# Altium schematic sheet 迷你四轴遥控器.SchDoc
size A3; PageSetup: Record=PageOptions|CenterHorizontal=True|CenterVertical=True|PrintScale=0.73|XCorrection=1.00|YCorrection=1.00|PrintKind=0|BorderSize=5000000|LeftOffset=0|BottomOffset=0|Orientation=2|PaperLength=1000|PaperWidth=1000|Scale=100|PaperSource=7|PrintQuality=-3|MediaType=1|DitherType=10|PrintScaleMode=1|PaperKind=A4|PaperIndex=9
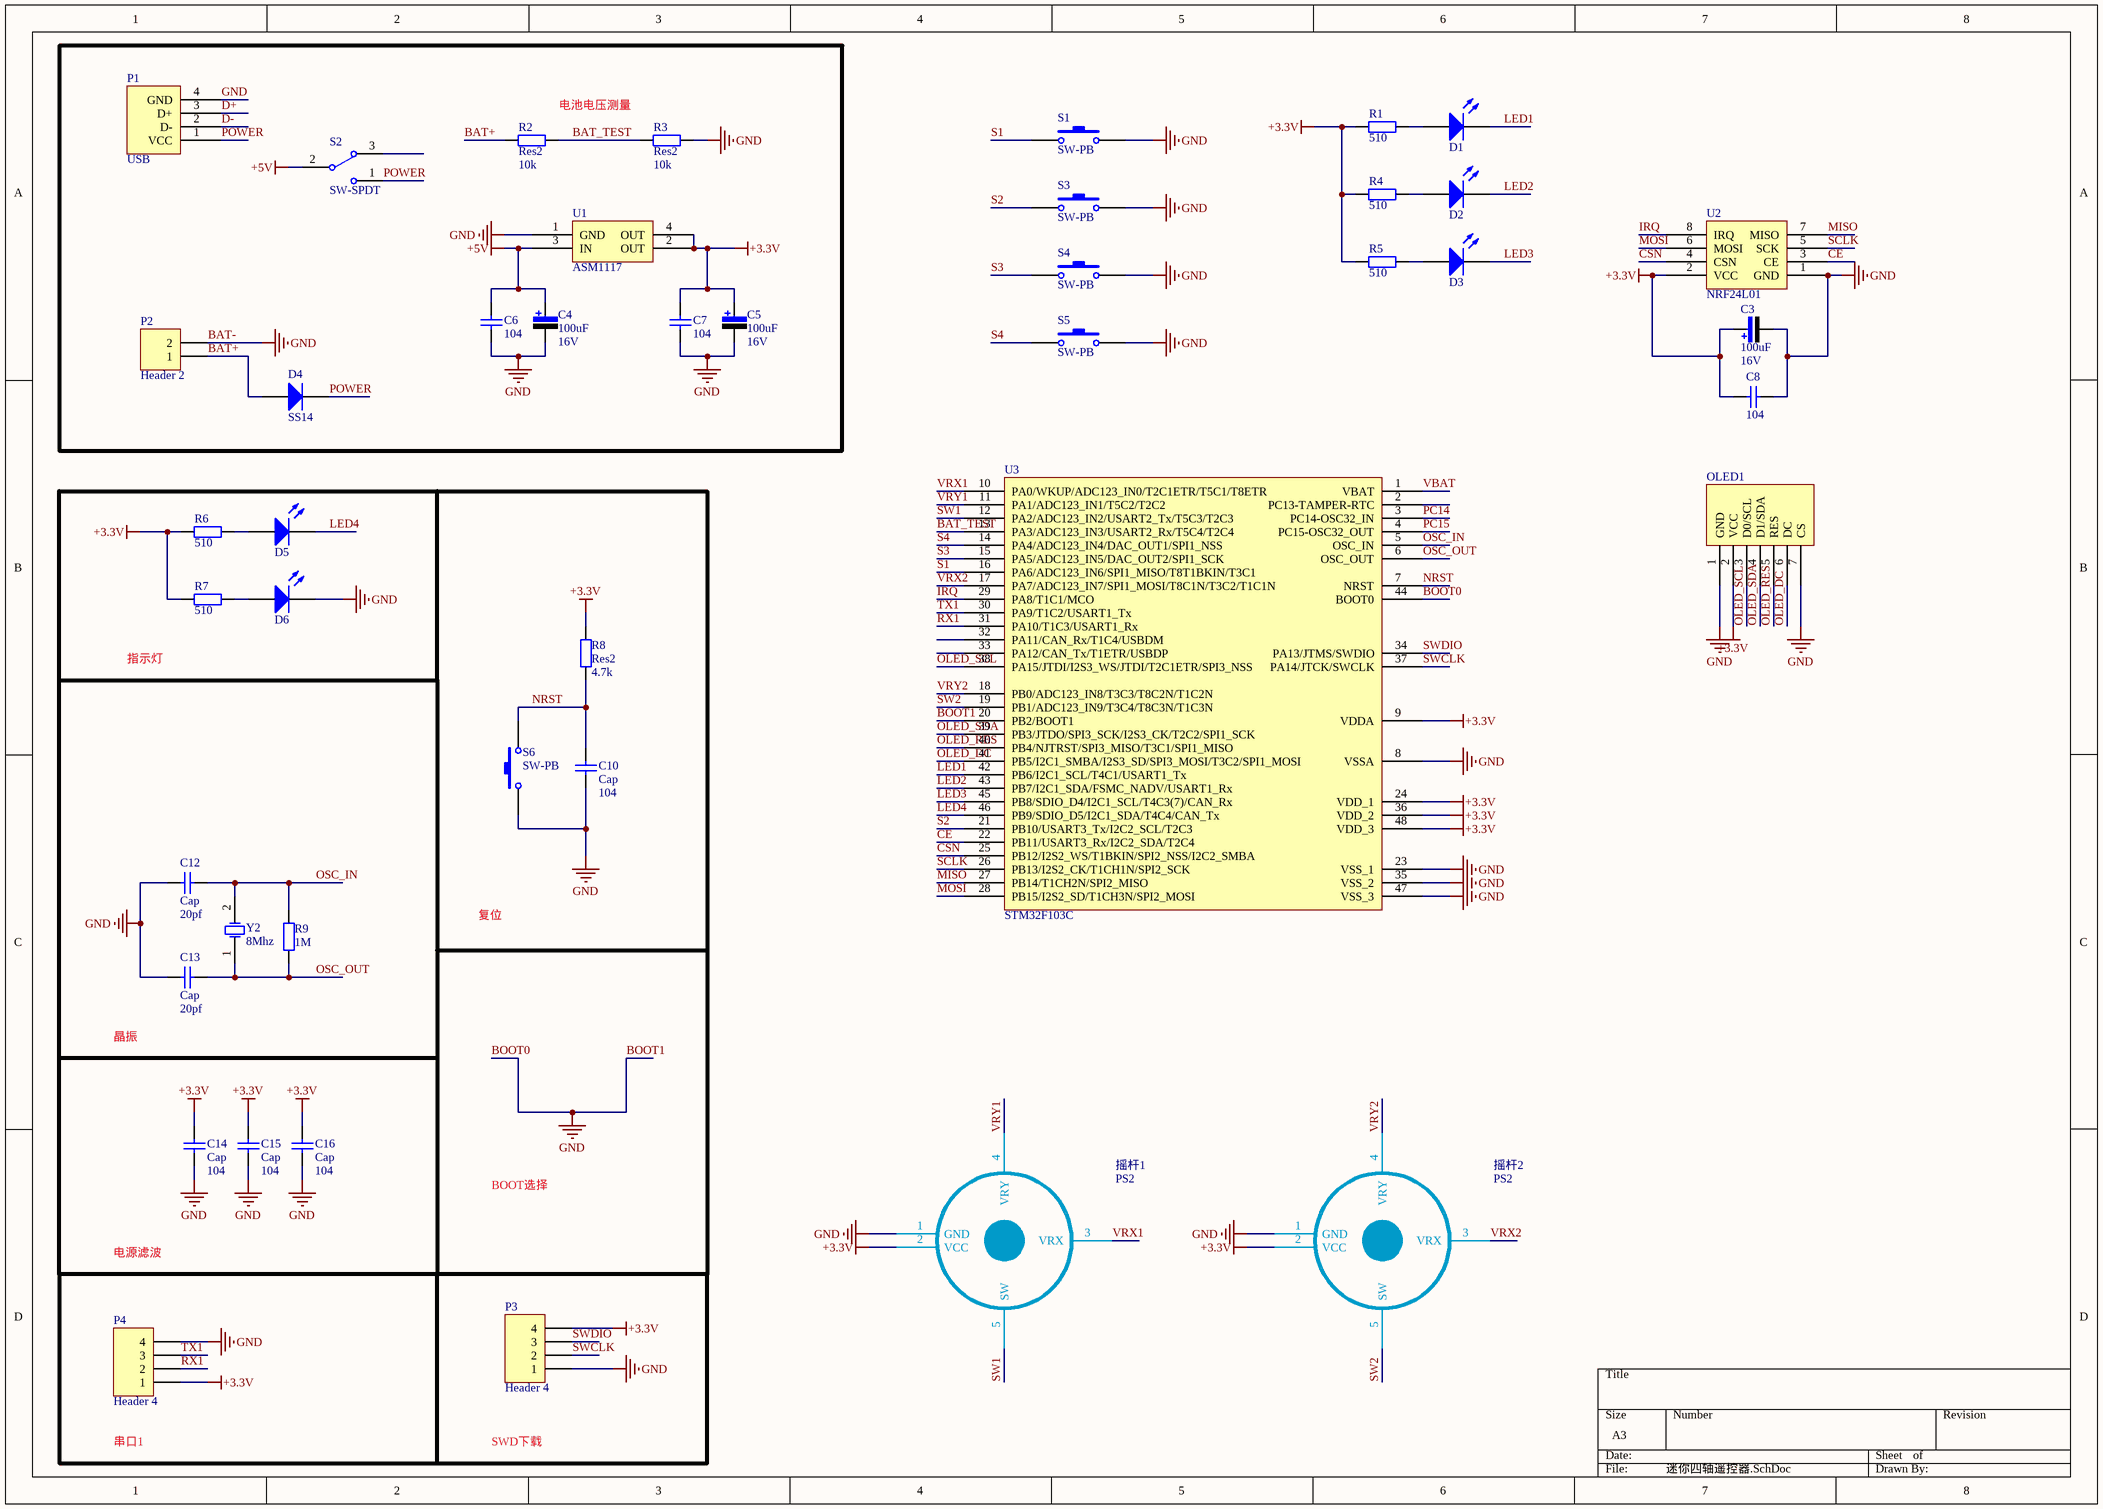
[diagram p0: 迷你四轴遥控器.SchDoc]

## Parts
C3  value 100uF  Vol: 16V  [CAP-7343]  (hidden comment: Cap Pol)
C4  value 100uF  Vol: 16V  [CAP-7343]  (hidden comment: Cap Pol)
C5  value 100uF  Vol: 16V  [CAP-7343]  (hidden comment: Cap Pol)
C6  value 104  [C-0805]  (hidden comment: Cap)
C7  value 104  [C-0805]  (hidden comment: Cap)
C8  value 104  [C-0805]  (hidden comment: Cap)
C10  Cap  value 104  [C-0805]
C12  Cap  value 20pf  [C-0805]
C13  Cap  value 20pf  [C-0805]
C14  Cap  value 104  [C-0805]
C15  Cap  value 104  [C-0805]
C16  Cap  value 104  [C-0805]
D1  LED0  [LED_0805]  (value not drawn)
D2  LED0  [LED_0805]  (value not drawn)
D3  LED0  [LED_0805]  (value not drawn)
D4  SS14  [DO214AA]
D5  LED0  [LED_0805]  (value not drawn)
D6  LED0  [LED_0805]  (value not drawn)
OLED1  OLDE  [OLED -简版]  (value not drawn)
P1  USB  [USB_MICRO]
P2  Header 2  [HDR1X2]
P3  Header 4  [HDR1X4]
P4  Header 4  [HDR1X4]
R1  value 510  [0603-1]  (hidden comment: Res1)
R2  Res2  value 10k  [0603-1]
R3  Res2  value 10k  [0603-1]
R4  value 510  [0603-1]  (hidden comment: Res1)
R5  value 510  [0603-1]  (hidden comment: Res1)
R6  value 510  [0603-1]  (hidden comment: Res1)
R7  value 510  [0603-1]  (hidden comment: Res1)
R8  Res2  value 4.7k  [0603-1]
R9  value 1M  [0805]  (hidden comment: Res1)
S1  SW-PB  [贴片开关]
S2  SW-SPDT  [开关-3pin]
S3  SW-PB  [贴片开关]
S4  SW-PB  [贴片开关]
S5  SW-PB  [贴片开关]
S6  SW-PB  [贴片开关]
U1  ASM1117  [SOT-223]
U2  NRF24L01  [NRF24L01]
U3  STM32F103C  [LQFP-48_M]
Y2  8Mhz  [X-SM49]
摇杆1  PS2  [PS2游戏摇杆]
摇杆2  PS2  [PS2游戏摇杆]

## Blocks framed on the sheet
电池电压测量: C4-C7 D4 P1 P2 R2 R3 S2 U1

## Nets
+3.3V: C3.1 C5.1 C7.1 C8.1 C14.2 C15.2 C16.2 OLED1.2(VCC) P3.4 P4.1 R1.1 R4.1 R5.1 R6.1 R7.1 R8.2 U1.2(OUT) U1.4(OUT) U2.2(VCC) U3.9(VDDA) U3.24(VDD_1) U3.36(VDD_2) U3.48(VDD_3) 摇杆1.2(VCC) 摇杆2.2(VCC)
+5V: C4.1 C6.1 S2.2 U1.3(IN)
BAT-: C3.2 C4.2 C5.2 C6.2 C7.2 C8.2 C10.1 C12.2 C13.2 C14.1 C15.1 C16.1 D6.2(K) OLED1.1(GND) OLED1.7(CS) P1.4(GND) P2.2 P3.1 P4.4 R3.2 S1.2 S3.2 S4.2 S5.2 S6.1 U1.1(GND) U2.1(GND) U3.8(VSSA) U3.20(PB2/BOOT1) U3.23(VSS_1) U3.35(VSS_2) U3.44(BOOT0) U3.47(VSS_3) 摇杆1.1(GND) 摇杆2.1(GND)  [also labelled BOOT0, BOOT1, GND]
BAT+: D4.1(A) P2.1 R2.1
BAT_TEST: R2.2 R3.1 U3.13(PA3/ADC123_IN3/USART2_Rx/T5C4/T2C4)
CE: U2.3(CE) U3.22(PB11/USART3_Rx/I2C2_SDA/T2C4)
CSN: U2.4(CSN) U3.25(PB12/I2S2_WS/T1BKIN/SPI2_NSS/I2C2_SMBA)
D+: P1.3(D+)
D-: P1.2(D-)
IRQ: U2.8(IRQ) U3.29(PA8/T1C1/MCO)
LED1: D1.2(K) U3.42(PB6/I2C1_SCL/T4C1/USART1_Tx)
LED2: D2.2(K) U3.43(PB7/I2C1_SDA/FSMC_NADV/USART1_Rx)
LED3: D3.2(K) U3.45(PB8/SDIO_D4/I2C1_SCL/T4C3(7)/CAN_Rx)
LED4: D5.2(K) U3.46(PB9/SDIO_D5/I2C1_SDA/T4C4/CAN_Tx)
MISO: U2.7(MISO) U3.27(PB14/T1CH2N/SPI2_MISO)
MOSI: U2.6(MOSI) U3.28(PB15/I2S2_SD/T1CH3N/SPI2_MOSI)
NRST: C10.2 R8.1 S6.2 U3.7(NRST)
OLED_DC: OLED1.6(DC) U3.41(PB5/I2C1_SMBA/I2S3_SD/SPI3_MOSI/T3C2/SPI1_MOSI)
OLED_RES: OLED1.5(RES) U3.40(PB4/NJTRST/SPI3_MISO/T3C1/SPI1_MISO)
OLED_SCL: OLED1.3(D0/SCL) U3.38(PA15/JTDI/I2S3_WS/JTDI/T2C1ETR/SPI3_NSS)
OLED_SDA: OLED1.4(D1/SDA) U3.39(PB3/JTDO/SPI3_SCK/I2S3_CK/T2C2/SPI1_SCK)
OSC_IN: C12.1 R9.2 U3.5(OSC_IN) Y2.2(OSC2)
OSC_OUT: C13.1 R9.1 U3.6(OSC_OUT) Y2.1(OSC1)
PC14: U3.3(PC14-OSC32_IN)
PC15: U3.4(PC15-OSC32_OUT)
POWER: D4.2(K) P1.1(VCC) S2.1
RX1: P4.2 U3.31(PA10/T1C3/USART1_Rx)
S1: S1.1 U3.16(PA6/ADC123_IN6/SPI1_MISO/T8T1BKIN/T3C1)
S2: S3.1 U3.21(PB10/USART3_Tx/I2C2_SCL/T2C3)
S3: S4.1 U3.15(PA5/ADC123_IN5/DAC_OUT2/SPI1_SCK)
S4: S5.1 U3.14(PA4/ADC123_IN4/DAC_OUT1/SPI1_NSS)
SCLK: U2.5(SCK) U3.26(PB13/I2S2_CK/T1CH1N/SPI2_SCK)
SW1: U3.12(PA2/ADC123_IN2/USART2_Tx/T5C3/T2C3) 摇杆1.5(SW)
SW2: U3.19(PB1/ADC123_IN9/T3C4/T8C3N/T1C3N) 摇杆2.5(SW)
SWCLK: P3.2 U3.37(PA14/JTCK/SWCLK)
SWDIO: P3.3 U3.34(PA13/JTMS/SWDIO)
TX1: P4.3 U3.30(PA9/T1C2/USART1_Tx)
VBAT: U3.1(VBAT)
VRX1: U3.10(PA0/WKUP/ADC123_IN0/T2C1ETR/T5C1/T8ETR) 摇杆1.3(VRX)
VRX2: U3.17(PA7/ADC123_IN7/SPI1_MOSI/T8C1N/T3C2/T1C1N) 摇杆2.3(VRX)
VRY1: U3.11(PA1/ADC123_IN1/T5C2/T2C2) 摇杆1.4(VRY)
VRY2: U3.18(PB0/ADC123_IN8/T3C3/T8C2N/T1C2N) 摇杆2.4(VRY)
NetD1_1: D1.1(A) R1.2
NetD2_1: D2.1(A) R4.2
NetD3_1: D3.1(A) R5.2
NetD5_1: D5.1(A) R6.2
NetD6_1: D6.1(A) R7.2

Not connected (* = marked no-connect by the designer): S2 3; U3 2(PC13-TAMPER-RTC) 32(PA11/CAN_Rx/T1C4/USBDM) 33(PA12/CAN_Tx/T1ETR/USBDP)

## Notes on the sheet
- 指示灯
- 复位
- 晶振
- BOOT选择
- 电源滤波
- 串口1
- SWD下载

## Library data of the parts
C3-C5 = Cap Pol: 极性电解电容; Published: 8-Jun-2000; LatestRevisionDate: 17-Jul-2002; LatestRevisionNote: Re-released for DXP Platform.; PackageReference: RB7.6-15; Publisher: Altium Limited
C6-C8 = Cap: 无极性电容; Published: 8-Jun-2000; LatestRevisionDate: 17-Jul-2002; LatestRevisionNote: Re-released for DXP Platform.; PackageReference: RAD-0.3; Publisher: Altium Limited
C10 C12-C16 = Cap: Capacitor; Published: 8-Jun-2000; LatestRevisionDate: 17-Jul-2002; LatestRevisionNote: Re-released for DXP Platform.; PackageReference: RAD-0.3; Publisher: Altium Limited; PackageDescription: Radial Cap, Thru-Hole; 2 Leads; 0.3 in Pin Spacing
D1-D3 D5 D6 = LED0: 发光二极管; Published: 8-Jun-2000; LatestRevisionDate: 08-Jul-2005; LatestRevisionNote: Mech Layer 1 removed.; PackageReference: LED-0; Publisher: Altium Limited
D4 = Diode 1N4007: 1 Amp General Purpose Rectifier; Published: 8-Jun-2000; LatestRevisionDate: 17-Jul-2002; LatestRevisionNote: Re-released for DXP Platform.; DatasheetVersion: 1998; PackageVersion: Aug-1999; PackageReference: DO-41; Publisher: Altium Limited; PackageDescription: Diode, Axial; Body 5.2 x 2.7 mm (LxDia. max), Lead Dia. 0.86 mm (max); Code_JEDEC: DO-204-AL; ComponentLink1Description: Manufacturer Link; ComponentLink1URL: http://www.fairchildsemi.com/; ComponentLink2Description: Datasheet; ComponentLink2URL: http://www.fairchildsemi.com/ds/1N%2F1N4001.pdf
OLED1 = OLED-0.96寸
P2 = Header 2: Header, 2-Pin; LatestRevisionDate: 17-Jul-2002; LatestRevisionNote: Re-released for DXP Platform.; Publisher: Altium Limited
P3 P4 = Header 4: Header, 4-Pin; LatestRevisionDate: 17-Jul-2002; LatestRevisionNote: Re-released for DXP Platform.; Publisher: Altium Limited
R1 R4-R7 R9 = Res1: 贴片电阻; Published: 8-Jun-2000; LatestRevisionDate: 17-Jul-2002; LatestRevisionNote: Re-released for DXP Platform.; PackageReference: AXIAL-0.4; Publisher: Altium Limited
R2 R3 R8 = Res2: Resistor; Published: 8-Jun-2000; LatestRevisionDate: 17-Jul-2002; LatestRevisionNote: Re-released for DXP Platform.; PackageReference: AXIAL-0.4; Publisher: Altium Limited; PackageDescription: Axial Device, Thru-Hole; 2 Leads; 0.4 in Pin Spacing
S1 S3-S6 = SW-PB: Switch; Published: 24-Mar-1999; LatestRevisionDate: 17-Jul-2002; LatestRevisionNote: Re-released for DXP Platform.; PackageReference: SPST-2; Publisher: Altium Limited; PackageDescription: Switch; 2 Leads
S2 = SW-SPDT: SPDT Subminiature Toggle Switch, Right Angle Mounting, Vertical Actuation; Published: 24-Mar-1999; LatestRevisionDate: 17-Dec-2003; LatestRevisionNote: Schematic revised, PCB Footprint replaced.; DatasheetVersion: 05-Dec-2000; PackageReference: TL36WW15050; Publisher: Altium Limited; PackageDescription: Switch; 4 Leads; ComponentLink1Description: Manufacturer Link; ComponentLink1URL: http://www.apem.com
U1 = ASM1117: 3.3V稳压芯片
U3 = STM32F103C: STM32单片机48引脚
Y2 = XTAL: Crystal Oscillator; Published: 8-Jun-2000; LatestRevisionDate: 17-Jul-2002; LatestRevisionNote: Re-released for DXP Platform.; PackageReference: R38; Publisher: Altium Limited; PackageDescription: Crystal, Thru-Hole; 2 Leads; Body 3.1 x 8.2 mm (Dia.xH)
摇杆1 摇杆2 = PS2游戏摇杆